# Altium schematic sheet ADCS board.SchDoc
size A
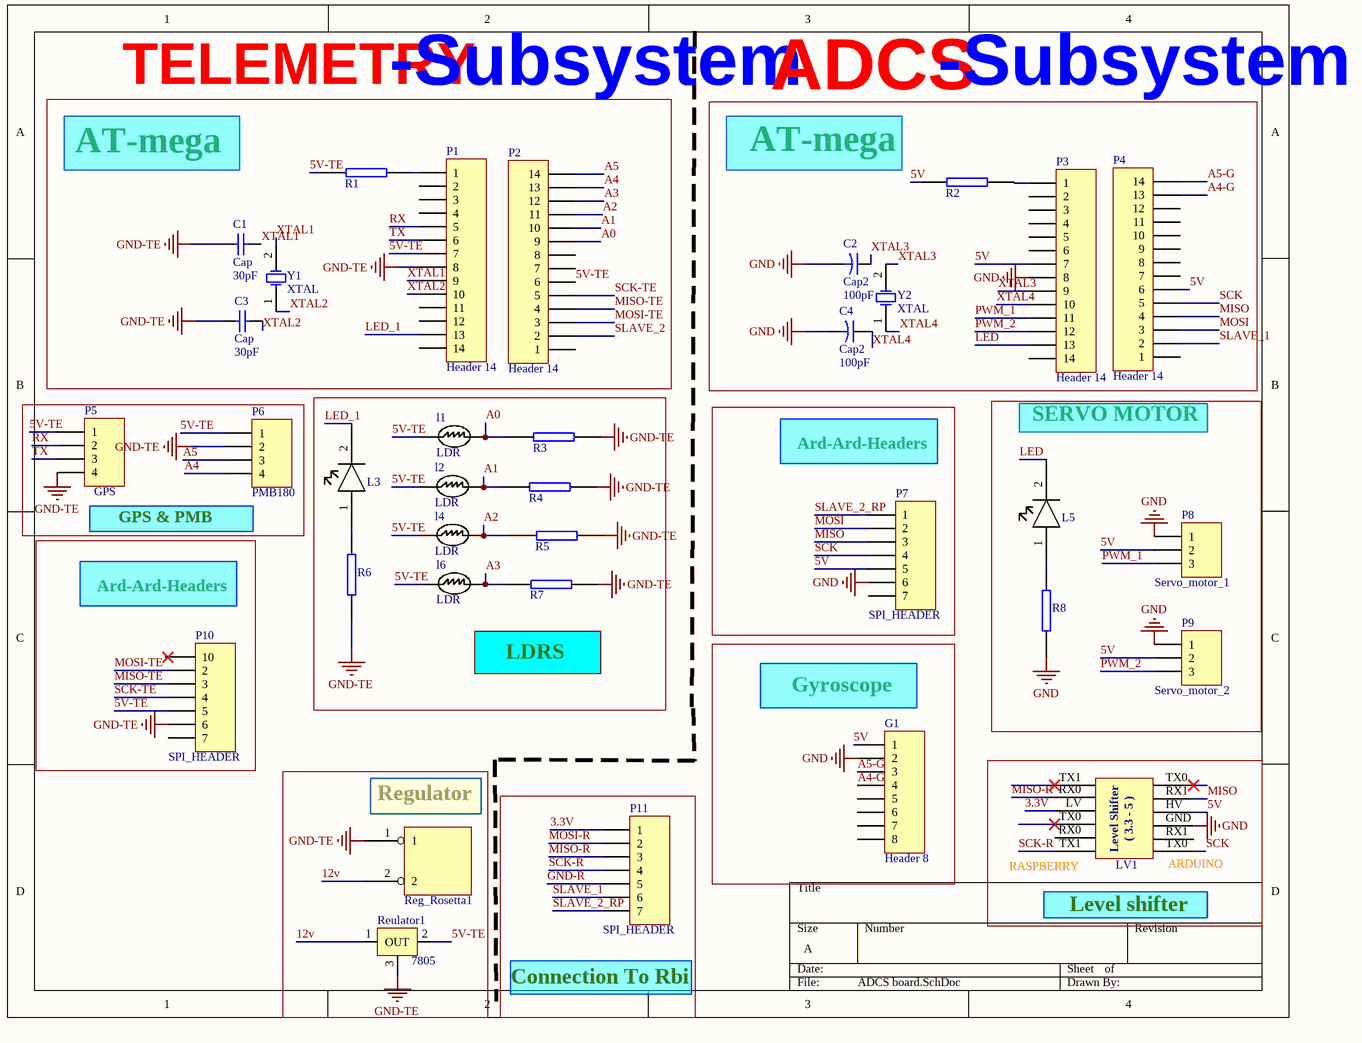
[diagram p0: ADCS board.SchDoc]

## Parts
C1  Cap  value 30pF  [RAD-0.3]
C2  Cap2  value 100pF  [CAPR5-4X5]
C3  Cap  value 30pF  [RAD-0.3]
C4  Cap2  value 100pF  [CAPR5-4X5]
G1  Header 8  [HDR1X8]
l1  LDR  [ldr]
l2  LDR  [ldr]
L3  LED  [LED]  (value not drawn)
l4  LDR  [ldr]
L5  LED  [LED]  (value not drawn)
l6  LDR  [ldr]
LV1  used in connection between 2 different workink voltage microcontrollers like ( RPI and ARUONO) .  [Level shifter]  (value not drawn)
P1  Header 14  [HDR1X14]
P2  Header 14  [HDR1X14]
P3  Header 14  [HDR1X14]
P4  Header 14  [HDR1X14]
P5  GPS  [HDR1X4]
P6  PMB180  [HDR1X4]
P7  SPI_HEADER  [HDR1X7]
P8  Servo_motor_1  [HDR1X3]
P9  Servo_motor_2  [HDR1X3]
P10  SPI_HEADER  [HDR1X7]
P11  SPI_HEADER  [HDR1X7]
R1  resistor  [Resistor]  (value not drawn)
R2  resistor  [Resistor]  (value not drawn)
R3  resistor  [Resistor]  (value not drawn)
R4  resistor  [Resistor]  (value not drawn)
R5  resistor  [Resistor]  (value not drawn)
R6  resistor  [Resistor]  (value not drawn)
R7  resistor  [Resistor]  (value not drawn)
R8  resistor  [Resistor]  (value not drawn)
Reg_Rosetta1  Rossetta  [Rossetta 2-pin]  (value not drawn)
Reulator1  7805  [7805 REGULATOR]
Y1  XTAL  [R38]
Y2  XTAL  [R38]

## Blocks framed on the sheet
-Subsystem: C1 C3 P1 P2 R1 Y1
GPS & PMB: P5 P6
LDRS: l1 l2 L3 l4 l6 R3-R7
Ard-Ard-Headers: P7
SERVO MOTOR: L5 P8 P9 R8
Ard-Ard-Headers: P10
Gyroscope: G1
Regulator: Reg_Rosetta1 Reulator1
Level shifter: LV1
Connection To Rbi: P11

## Nets
GND: C2.2 C4.2 G1.2 LV1.GND P3.8 P7.6 P8.1 P9.1 R8.2
GND-TE: C1.2 C3.1 P1.8 P5.4 P6.2 P10.6 R3.2 R4.2 R5.2 R6.2 R7.2 Reg_Rosetta1.1 Reulator1.3(BASE)
3.3V: LV1.LV P11.1
5V: G1.1 LV1.HV P3.7 P4.6 P7.5 P8.2 P9.2 R2.1
5V-TE: l1.2 l2.2 l4.2 l6.2 P1.7 P2.6 P5.1 P6.1 P10.5 R1.1 Reulator1.2(OUT)
12v: Reg_Rosetta1.2 Reulator1.1(IN)
A0: l1.1 P2.9 R3.1
A1: l2.1 P2.10 R4.1
A2: l4.1 P2.11 R5.1
A3: l6.1 P2.12 R7.1
A4: P2.13 P6.4
A4-G: G1.4 P4.13
A5: P2.14 P6.3
A5-G: G1.3 P4.14
GND-R: P11.5
LED: L5.2 P3.13
LED_1: L3.2 P1.13
MISO: LV1.RX1 P4.4 P7.3
MISO-R: LV1.RX0 P11.3
MISO-TE: P2.4 P10.3
MOSI: P4.3 P7.2
MOSI-R: P11.2
MOSI-TE: P2.3 P10.2
PWM_1: P3.11 P8.3
PWM_2: P3.12 P9.3
RX: P1.5 P5.2
SCK: LV1.TX0 P4.5 P7.4
SCK-R: LV1.TX1 P11.4
SCK-TE: P2.5 P10.4
SLAVE_1: P4.2 P11.6
SLAVE_2: P2.2
SLAVE_2_RP: P7.1 P11.7
TX: P1.6 P5.3
XTAL1: C1.2 P1.9 Y1.2(OSC2)
XTAL2: C3.2 P1.10 Y1.1(OSC1)
XTAL3: C2.1 P3.9 Y2.2(OSC2)
XTAL4: C4.1 P3.10 Y2.1(OSC1)
NetL3_1: L3.1 R6.1
NetL5_1: L5.1 R8.1
NetP1_1: P1.1 R1.2
NetP3_1: P3.1 R2.2

Not connected (* = marked no-connect by the designer): G1 5 6 7 8; P1 2 3 4 11 12 14; P2 1 7 8; P3 2 3 4 5 6 14; P4 1 7 8 9 10 11 12; P7 7; P10 7 10*

## Notes on the sheet
- TELEMETRY
- -Subsystem
- AT-mega
- ADCS
- (near LV1) RASPBERRY
- (near LV1) ARDUINO
- (in symbol Level-shifter) ( 3.3 - 5 ); Level Shifter

## Library data of the parts
C1 C3 = Cap: Capacitor; Published: 8-Jun-2000; LatestRevisionDate: 17-Jul-2002; LatestRevisionNote: Re-released for DXP Platform.; PackageReference: RAD-0.3; Publisher: Altium Limited; PackageDescription: Radial Cap, Thru-Hole; 2 Leads; 0.3 in Pin Spacing
C2 C4 = Cap2: Capacitor; Published: 23-Sep-2002; PackageReference: CAPR5-4X5; Publisher: Altium Limited; PackageDescription: Capacitor; 2 Leads
G1 = Header 8: Header, 8-Pin; LatestRevisionDate: 17-Jul-2002; LatestRevisionNote: Re-released for DXP Platform.; Publisher: Altium Limited
LV1 = Level-shifter: (3.3-5)
P1-P4 = Header 14: Header, 14-Pin; LatestRevisionDate: 17-Jul-2002; LatestRevisionNote: Re-released for DXP Platform.; Publisher: Altium Limited
P5 P6 = Header 4: Header, 4-Pin; LatestRevisionDate: 17-Jul-2002; LatestRevisionNote: Re-released for DXP Platform.; Publisher: Altium Limited
P7 P10 P11 = Header 7: Header, 7-Pin; LatestRevisionDate: 17-Jul-2002; LatestRevisionNote: Re-released for DXP Platform.; Publisher: Altium Limited
P8 P9 = Header 3: Header, 3-Pin; LatestRevisionDate: 17-Jul-2002; LatestRevisionNote: Re-released for DXP Platform.; Publisher: Altium Limited
Reulator1 = 7805 Regulator
Y1 Y2 = XTAL: Crystal Oscillator; Published: 8-Jun-2000; LatestRevisionDate: 17-Jul-2002; LatestRevisionNote: Re-released for DXP Platform.; PackageReference: R38; Publisher: Altium Limited; PackageDescription: Crystal, Thru-Hole; 2 Leads; Body 3.1 x 8.2 mm (Dia.xH)
L3 L5 = LED: Created By: Nour Aldin
R1-R8 = resistor: Created By: Nour Aldin